# Altium schematic sheet teensy_base.SchDoc
size 363 x 114 mm; Origin: Eagle
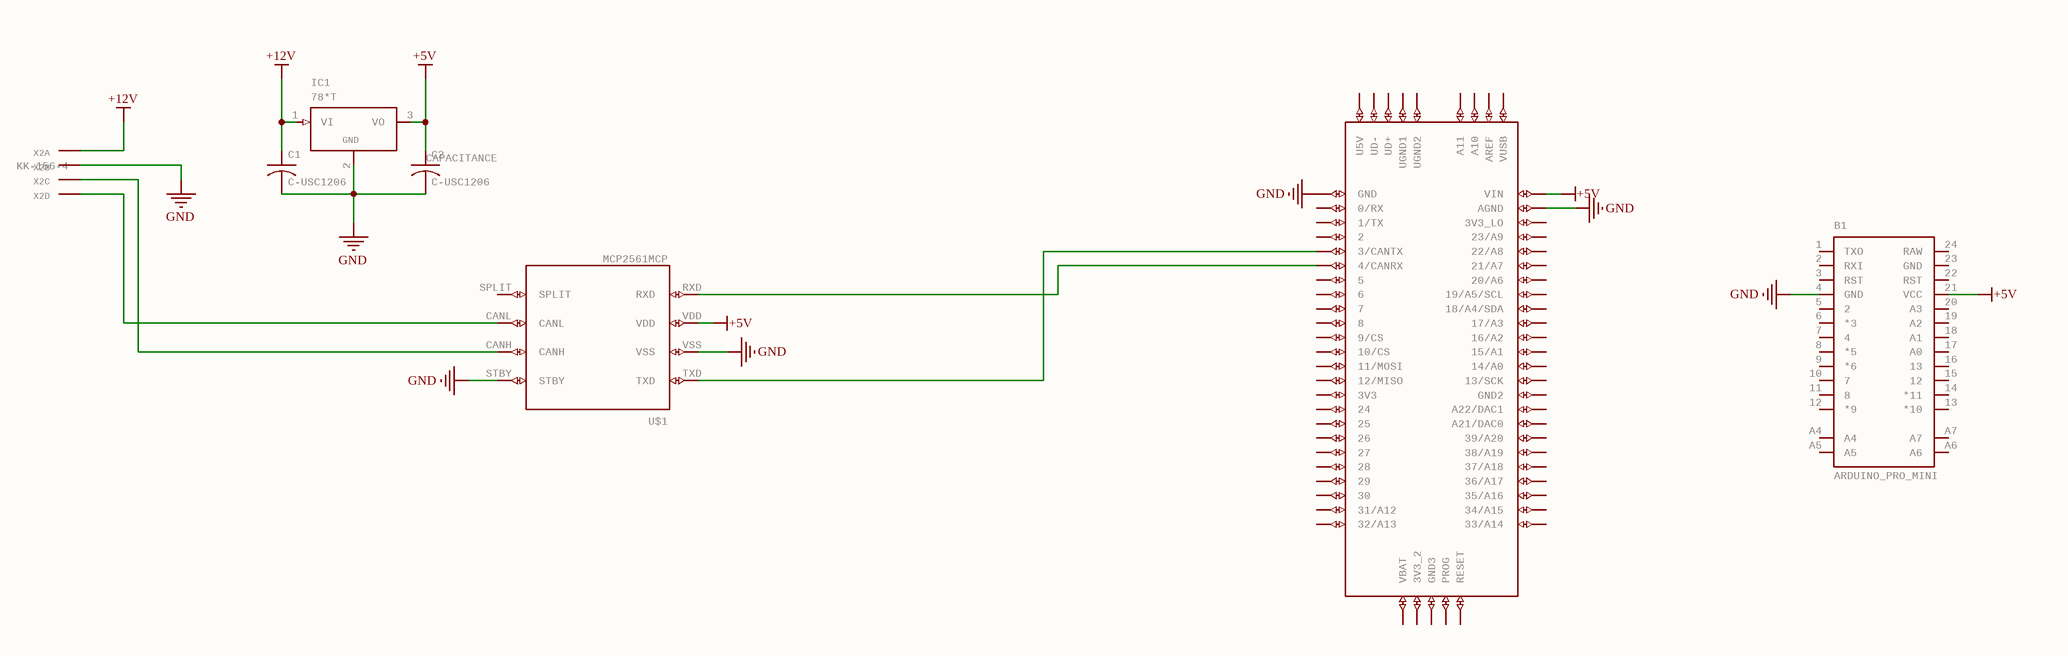
[diagram p0: teensy_base.SchDoc]

## Parts
B1  ARDUINO_PRO_MINI  [ARDUINO_PRO_MINI]
C1  C-USC1206  [C1206]
C2  C-USC1206  [C1206]
IC1  78*T  [TO220H]
U$1  MCP2561MCP  [MCP2561_PDIP]
U$2  TEENSY_3.5/3.6  [TEENSY_3.5/3.6]  (value not drawn)
X2  KK-156-4  [KK-156-4]  (parts A,B,C,D of 4)

## Nets
+5V: B1.21(VCC) C2.1 IC1.3(VO) U$1.VDD U$2.VIN
+12V: C1.1 IC1.1(VI) X2.1(S)
GND: B1.4(GND) C1.2 C2.2 IC1.2(GND) U$1.STBY U$1.VSS U$2.AGND U$2.GND X2.2(S)
NetU$1_CANH: U$1.CANH X2.3(S)
NetU$1_CANL: U$1.CANL X2.4(S)
NetU$1_RXD: U$1.RXD U$2.4/CANRX
NetU$1_TXD: U$1.TXD U$2.3/CANTX

Not connected (* = marked no-connect by the designer): B1 1(TXO) 2(RXI) 3(RST) 5(2) 6(*3) 7(4) 8(*5) 9(*6) 10(7) 11(8) 12(*9) 13(*10) 14(*11) 15(12) 16(13) 17(A0) 18(A1) 19(A2) 20(A3) 22(RST) 23(GND) 24(RAW) A4 A5 A6 A7; U$1 SPLIT; U$2 0/RX 1/TX 2 3V3 3V3_2 3V3_LO 5 6 7 8 9/CS 10/CS 11/MOSI 12/MISO 13/SCK 14/A0 15/A1 16/A2 17/A3 18/A4/SDA 19/A5/SCL 20/A6 21/A7 21/DAC0(A21/DAC0) 22/A8 23/A9 24 25 26 27 28 29 30 31/A12 32/A13 33/A14 34/A15 35/A16 36/A17 37/A18 38/A19 39/A20 A10 A11 A22/DAC1 AREF GND2 GND3 PROG RESET U5V UD+ UD- UGND1 UGND2 VBAT VUSB

## Library data of the parts
B1 = ARDUINO_PRO_MINI: SparkFun Pro Mini     Pro Mini compatible footprint.    Dimensions: 0.7 x 1.3"  PCB Thickness: 0.8mm    SparkFun Products: 3.3V/8MHz  5V/16MHz; GateName_1: G$1; SymbolName_1: PRO_MINI; LibraryName: SparkFun-Boards; DeviceSetName: ARDUINO_PRO_MINI
C1 C2 = C-USC1206: CAPACITOR, American symbol; GateName_1: G$1; SymbolName_1: C-US; DeviceName: C1206; LibraryName: rcl; DeviceSetName: C-US; CAPACITANCE: CAPACITANCE
IC1 = 78*T: Positive VOLTAGE REGULATOR   Source: http://cache.national.com/ds/LM/LM78L05.pdf http://www.fairchildsemi.com/ds/LM/LM7805.pdf; GateName_1: A1; SymbolName_1: 78XX; DeviceName: T; DeviceSetName: 78*; LibraryName: linear; GND: GND
U$1 = MCP2561MCP: High-Speed CAN Transceiver See http://ww1.microchip.com/downloads/en/DeviceDoc/25167A.pdf The MCP2561/2 is a Microchip Technology Inc. second generation high-speed CAN transceiver. It serves as an interface between a CAN protocol controller and the physical two-wire CAN bus. The device meets the automotive requirements for high-speed (up to 1 Mb/s), low quiescent current, electromagnetic compatibility (EMC) and electrostatic discharge (ESD).; GateName_1: G$1; DeviceName: MCP; SymbolName_1: MCP2561; LibraryName: PoJD; DeviceSetName: MCP2561
U$2 = TEENSY_3.5/3.6: GateName_1: G$1; SymbolName_1: TEENSY_3.5/3.6; LibraryName: Teensy356; DeviceSetName: TEENSY_3.5/3.6
X2 = KK-156-4: KK 156 HEADER   Source: http://www.molex.com/pdm_docs/sd/026604100_sd.pdf; GateName_1: -1; SymbolName_1: MV; GateName_2: -2; SymbolName_2: M; GateName_3: -3; GateName_4: -4; SymbolName_3: M; SymbolName_4: M; LibraryName: con-molex; DeviceSetName: KK-156-4; MF: MF; MPN: MPN; OC_FARNELL: unknown; OC_NEWARK: unknown